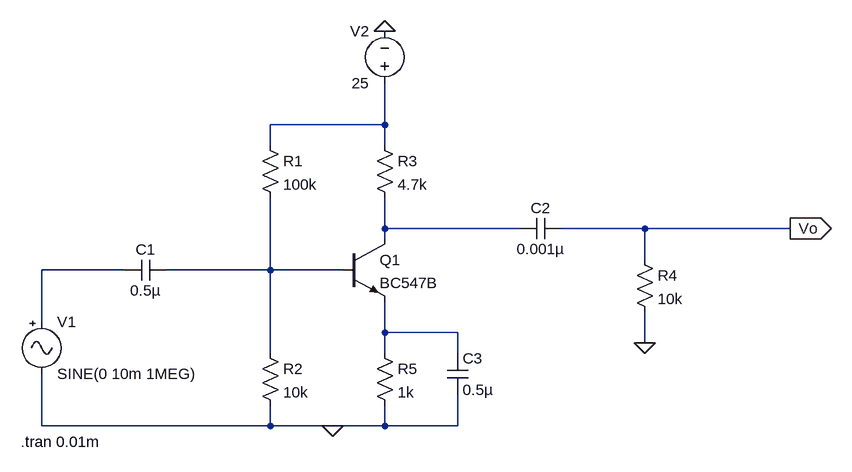
[diagram p0: schematic Automatic Gain Control circuit - 1.asc]
Automatic Gain Control circuit - 1.asc, the LTspice schematic file:
Version 4.1
SHEET 1 1096 680
WIRE 384 0 384 -64
WIRE 384 0 208 0
WIRE 208 32 208 0
WIRE 384 32 384 0
WIRE 384 160 384 112
WIRE 592 160 384 160
WIRE 784 160 656 160
WIRE 1008 160 784 160
WIRE 384 176 384 160
WIRE 784 208 784 160
WIRE -16 224 -144 224
WIRE 208 224 208 112
WIRE 208 224 48 224
WIRE 320 224 208 224
WIRE -144 304 -144 224
WIRE 384 320 384 272
WIRE 496 320 384 320
WIRE 784 336 784 288
WIRE 208 352 208 224
WIRE 384 352 384 320
WIRE 496 352 496 320
WIRE -144 464 -144 384
WIRE 208 464 208 432
WIRE 208 464 -144 464
WIRE 304 464 208 464
WIRE 384 464 384 432
WIRE 384 464 304 464
WIRE 496 464 496 416
WIRE 496 464 384 464
FLAG 784 336 0
FLAG 304 464 0
FLAG 384 -144 0
FLAG 1008 160 Vo
IOPIN 1008 160 Out
SYMBOL cap 48 208 R90
WINDOW 0 0 32 VBottom 2
WINDOW 3 32 32 VTop 2
SYMATTR InstName C1
SYMATTR Value 0.5µ
SYMBOL res 192 16 R0
SYMATTR InstName R1
SYMATTR Value 100k
SYMBOL res 192 336 R0
SYMATTR InstName R2
SYMATTR Value 10k
SYMBOL res 368 16 R0
SYMATTR InstName R3
SYMATTR Value 4.7k
SYMBOL npn 320 176 R0
SYMATTR InstName Q1
SYMATTR Value BC547B
SYMBOL cap 656 144 R90
WINDOW 0 0 32 VBottom 2
WINDOW 3 32 32 VTop 2
SYMATTR InstName C2
SYMATTR Value 0.001µ
SYMBOL res 768 192 R0
SYMATTR InstName R4
SYMATTR Value 10k
SYMBOL Misc\\signal -144 288 R0
WINDOW 123 0 0 Left 0
WINDOW 39 0 0 Left 0
SYMATTR InstName V1
SYMATTR Value SINE(0 10m 1MEG)
SYMBOL res 368 336 R0
SYMATTR InstName R5
SYMATTR Value 1k
SYMBOL cap 480 352 R0
SYMATTR InstName C3
SYMATTR Value 0.5µ
SYMBOL voltage 384 -48 R180
WINDOW 0 24 96 Left 2
WINDOW 3 24 16 Left 2
SYMATTR InstName V2
SYMATTR Value 25
TEXT -176 488 Left 2 !.tran 0.01m

The netlist it stands for:
* Automatic Gain Control circuit - 1.asc
C1 N004 N003 0.5µ
R1 N001 N004 100k
R2 N004 0 10k
R3 N001 N002 4.7k
Q1 N002 N004 N005 0 BC547B
C2 Vo N002 0.001µ
R4 Vo 0 10k
V1 N003 0 SINE(0 10m 1MEG)
R5 N005 0 1k
C3 N005 0 0.5µ
V2 N001 0 25
.model NPN NPN
.model PNP PNP
.lib standard.bjt
.tran 0.01m
.backanno
.end